# EAGLE schematic RAM (EAGLE 6.2)
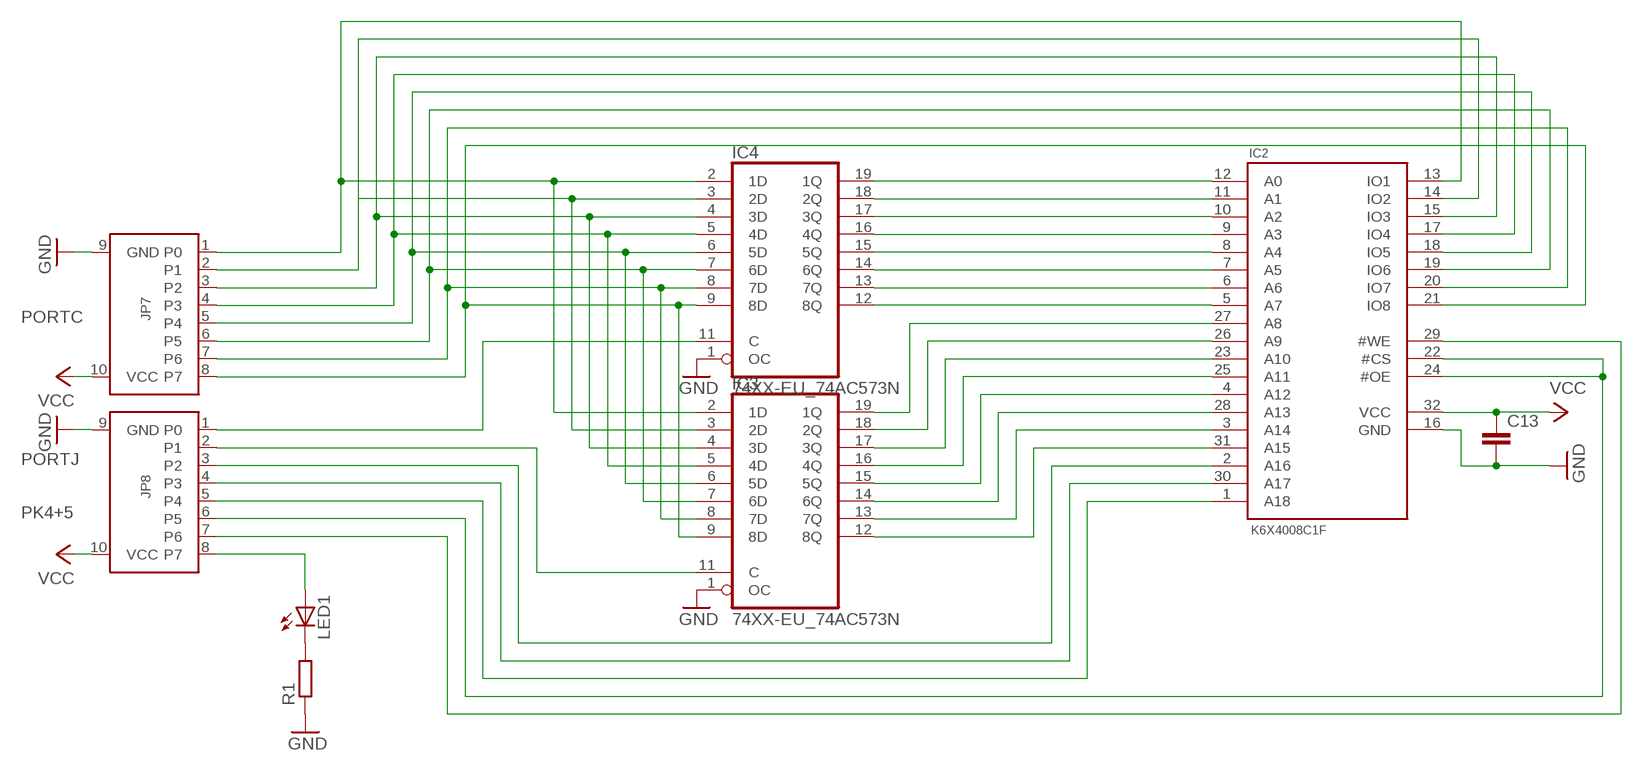
[diagram p0: schematic, sheet 1]

## Parts
C13  C-EU050-035X075  [C050-035X075]
IC2  K6X4008C1F  [DIP32]
IC3  74XX-EU_74AC573N  [74XX-EU_DIL20]
IC4  74XX-EU_74AC573N  [74XX-EU_DIL20]
JP7  0-ROBOTERNETZ-DEFINITIONEN_PORT  [0-ROBOTERNETZ-DEFINITIONEN_ML10]
JP8  0-ROBOTERNETZ-DEFINITIONEN_PORT  [0-ROBOTERNETZ-DEFINITIONEN_ML10]
LED1  LED5MM  [LED5MM]
R1  R-EU_0207/10  [0207/10]

## Nets
GND: C13.2 IC2.16(GND) IC3.1(OC) IC4.1(OC) JP7.9(GND) JP8.9(GND) R1.1
N$1: LED1.K(C) R1.2
N$2: JP8.8(P7) LED1.A
N$81: IC2.13(IO1) IC3.2(1D) IC4.2(1D) JP7.1(P0)
N$82: IC2.14(IO2) IC3.3(2D) IC4.3(2D) JP7.2(P1)
N$83: IC2.15(IO3) IC3.4(3D) IC4.4(3D) JP7.3(P2)
N$84: IC2.17(IO4) IC3.5(4D) IC4.5(4D) JP7.4(P3)
N$85: IC2.18(IO5) IC3.6(5D) IC4.6(5D) JP7.5(P4)
N$86: IC2.19(IO6) IC3.7(6D) IC4.7(6D) JP7.6(P5)
N$87: IC2.20(IO7) IC3.8(7D) IC4.8(7D) JP7.7(P6)
N$88: IC2.21(IO8) IC3.9(8D) IC4.9(8D) JP7.8(P7)
N$89: IC2.12(A0) IC4.19(1Q)
N$90: IC2.11(A1) IC4.18(2Q)
N$91: IC2.10(A2) IC4.17(3Q)
N$92: IC2.9(A3) IC4.16(4Q)
N$93: IC2.8(A4) IC4.15(5Q)
N$94: IC2.7(A5) IC4.14(6Q)
N$95: IC2.6(A6) IC4.13(7Q)
N$96: IC2.5(A7) IC4.12(8Q)
N$97: IC2.27(A8) IC3.19(1Q)
N$98: IC2.26(A9) IC3.18(2Q)
N$99: IC2.23(A10) IC3.17(3Q)
N$100: IC2.25(A11) IC3.16(4Q)
N$101: IC2.4(A12) IC3.15(5Q)
N$102: IC2.28(A13) IC3.14(6Q)
N$103: IC2.3(A14) IC3.13(7Q)
N$104: IC2.31(A15) IC3.12(8Q)
N$105: IC2.2(A16) JP8.3(P2)
N$106: IC2.30(A17) JP8.4(P3)
N$107: IC2.1(A18) JP8.5(P4)
N$108: IC2.22(#CS) IC2.24(#OE) JP8.6(P5)
N$109: IC2.29(#WE) JP8.7(P6)
N$119: IC4.11(C) JP8.1(P0)
N$120: IC3.11(C) JP8.2(P1)
VCC: C13.1 IC2.32(VCC) JP7.10(VCC) JP8.10(VCC)

## Notes on the sheet
- PORTC
- PORTJ
- PK4+5

## Power pins joined to a net without a drawn wire
GND: IC3.10(GND) IC4.10(GND)
VCC: IC3.20(VCC) IC4.20(VCC)

## Library data of the parts
C13 = resistor:C-EU: CAPACITOR, European symbol
IC2 = 00_User:K6X4008C1F
IC3 IC4 = LED_Cube:74XX-EU_74*573: 8-bit D latch BUS DRIVER
JP7 JP8 = LED_Cube:0-ROBOTERNETZ-DEFINITIONEN_PORT: Datenportstecker Kompatibel zu den Steckern des STK500
LED1 = led:LED: LED OSRAM: - CHIPLED LG R971, LG N971, LY N971, LG Q971, LY Q971, LO R971, LY R971 LH N974, LH R974 LS Q976, LO Q976, LY Q976 LO Q996 - Hyper CHIPLED LW Q18S LB Q993, LB Q99A, LB R99A - SideLED LS A670, LO A670, LY A670, LG A670, LP A670 LB A673, LV A673, LT A673, LW A673 LH A674 LY A675 LS A676, LA A676, LO A676, LY A676, LW A676 LS A679, LY A679, LG A679 - Hyper Micro SIDELED® LS Y876, LA Y876, LO Y876, LY Y876 LT Y87S - SmartLED LW L88C, LW L88S LB L89C, LB L89S, LG L890 LS L89K, LO L89K, LY L89K LS L896, LA L896, LO L896, LY L896 - TOPLED LS T670, LO T670, LY T670, LG T670, LP T670 LSG T670, LSP T670, LSY T670, LOP T670, LYG T670 LG T671, LOG T671, LSG T671 LB T673, LV T673, LT T673, LW T673 LH T674 LS T676, LA T676, LO T676, LY T676, LB T676, LH T676, LSB T676, LW T676 LB T67C, LV T67C, LT T67C, LS T67K, LO T67K, LY T67K, LW E67C LS E67B, LA E67B, LO E67B, LY E67B, LB E67C, LV E67C, LT E67C LW T67C LS T679, LY T679, LG T679 LS T770, LO T770, LY T770, LG T770, LP T770 LB T773, LV T773, LT T773, LW T773 LH T774 LS E675, LA E675, LY E675, LS T675 LS T776, LA T776, LO T776, LY T776, LB T776 LHGB T686 LT T68C, LB T68C - Hyper Mini TOPLED® LB M676 - Mini TOPLED Santana® LG M470 LS M47K, LO M47K, LY M47K Source: http://www.osram.convergy.de LUXEON: - LUMILED® LXK2-PW12-R00, LXK2-PW12-S00, LXK2-PW14-U00, LXK2-PW14-V00 LXK2-PM12-R00, LXK2-PM12-S00, LXK2-PM14-U00 LXK2-PE12-Q00, LXK2-PE12-R00, LXK2-PE12-S00, LXK2-PE14-T00, LXK2-PE14-U00 LXK2-PB12-K00, LXK2-PB12-L00, LXK2-PB12-M00, LXK2-PB14-N00, LXK2-PB14-P00, LXK2-PB14-Q00 LXK2-PR12-L00, LXK2-PR12-M00, LXK2-PR14-Q00, LXK2-PR14-R00 LXK2-PD12-Q00, LXK2-PD12-R00, LXK2-PD12-S00 LXK2-PH12-R00, LXK2-PH12-S00 LXK2-PL12-P00, LXK2-PL12-Q00, LXK2-PL12-R00 Source: www.luxeon.com KINGBRIGHT: KA-3528ASYC Source: www.kingbright.com
R1 = resistor:R-EU_: RESISTOR, European symbol

## Net classes
1 Power4A: width 1.143 mm
2 Power2A: width 0.762 mm
3 Power3A: width 1.016 mm